# EAGLE design Arduino_sensors (EAGLE 7.6.0)
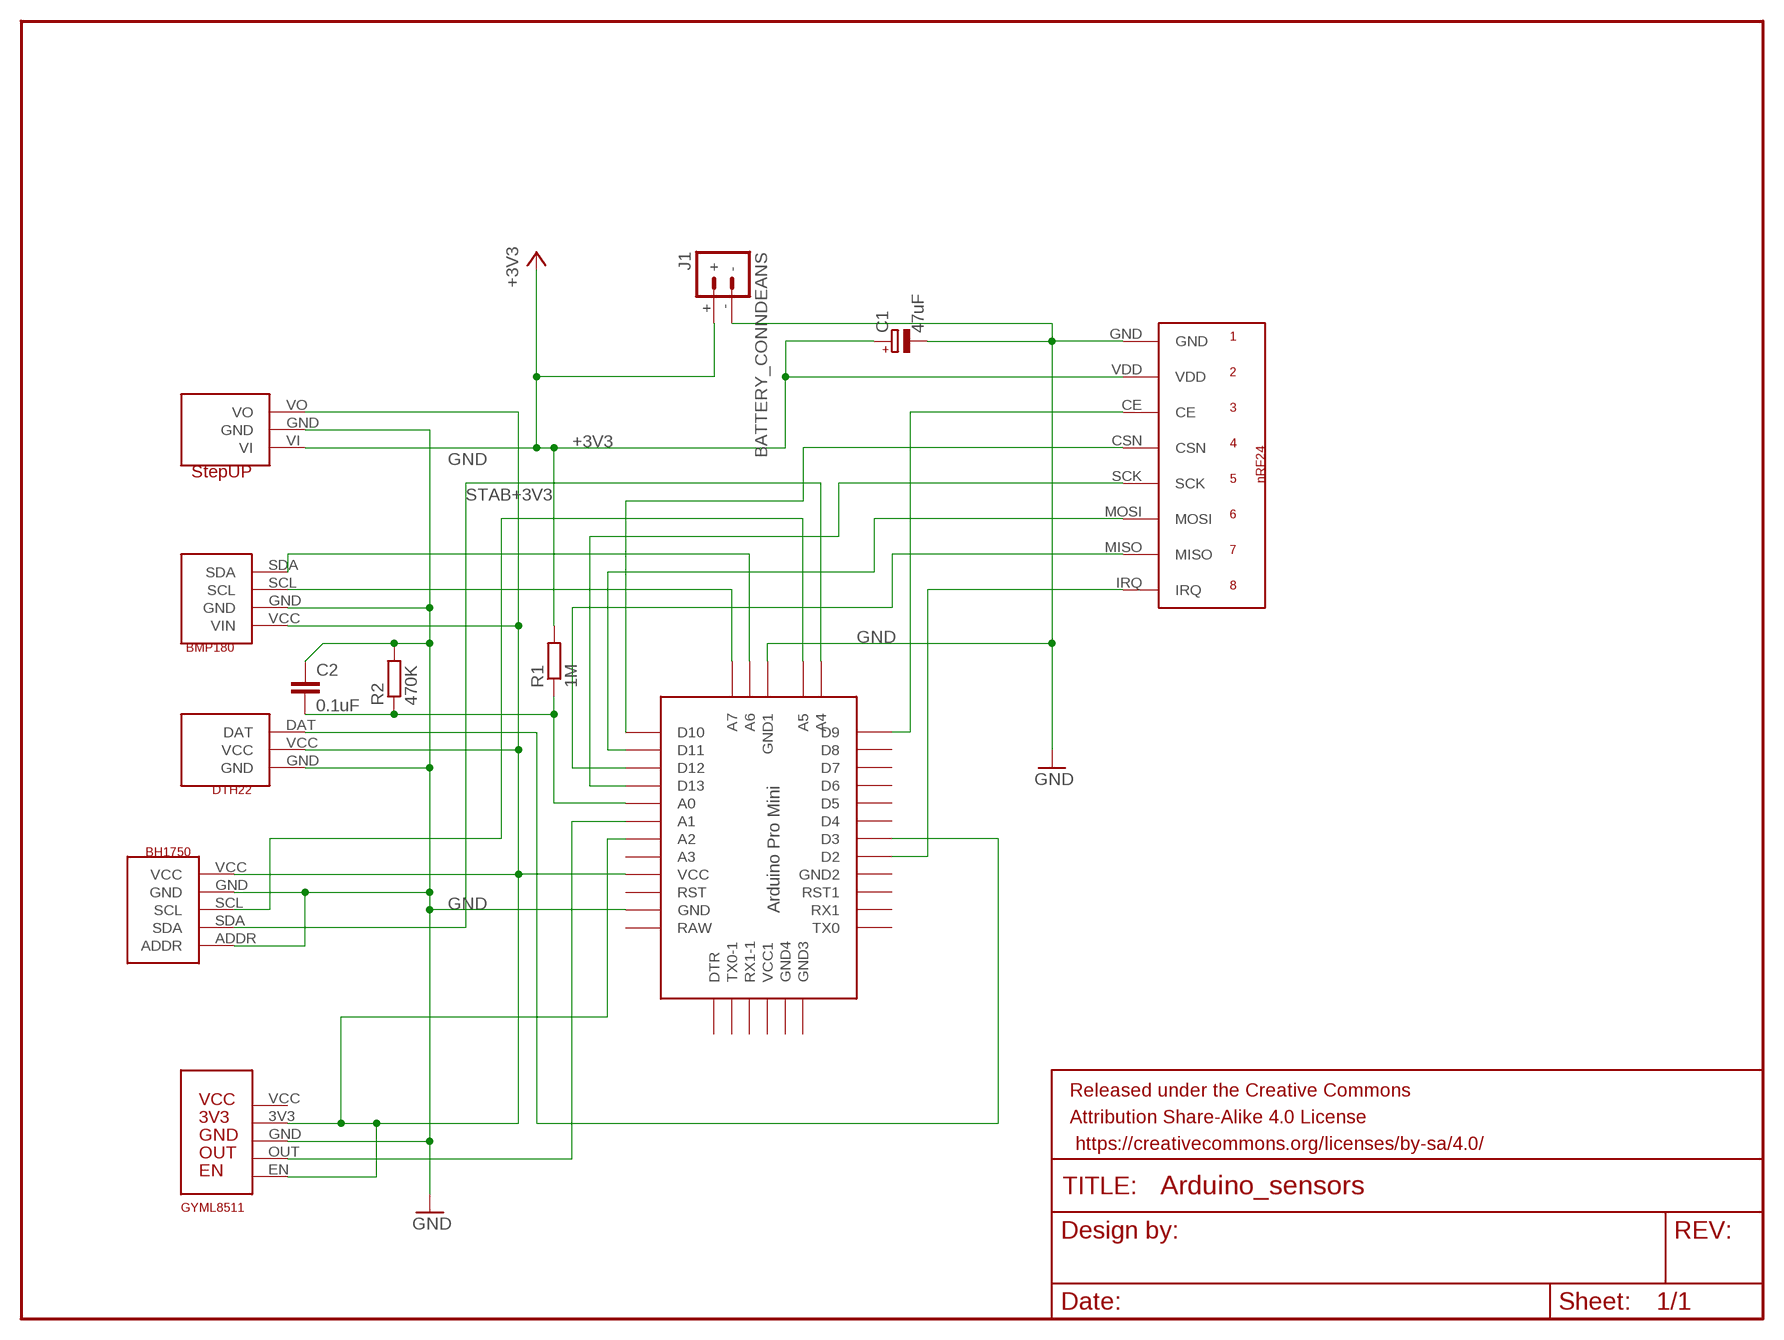
[diagram p0: schematic, sheet 1]

## Parts
ARDUINO_MINI  ABK-PRO-MINI  [ABK-PRO-MINI]
BH1  BH1750  [BH1750]
BMP1  BMP180  [BMP180]
C1  47uF  CPOL-EUE2.5-6  [E2,5-6]
C2  0.1uF  C-EU025-025X050  [C025-025X050]
DTH1  DTH22  [DHT22]
FRAME1  FRAME-LETTER  [CREATIVE_COMMONS]
J1  BATTERY_CONNDEANS  [DEANS]
R1  1M  R-EU_0207/7  [0207/7]
R2  470K  R-EU_0207/7  [0207/7]
STEPUP1  STEPUP  [STEPUP]
U$1  GY8511UV_SNR  [GYML8511]
U$2  NRF24  [NRF24]

## Nets
+3V3: C1.+ J1.+ R1.2 STEPUP1.VI U$2.VDD
GND: ARDUINO_MINI.GND ARDUINO_MINI.GND4(GND1) BH1.ADDR BH1.GND BMP1.GND C1.- C2.1 DTH1.GND J1.- R2.2 STEPUP1.GND U$1.GND U$2.GND
N$1: ARDUINO_MINI.D3 DTH1.DAT
N$2: ARDUINO_MINI.A1 U$1.OUT
N$3: ARDUINO_MINI.D9 U$2.CE
N$4: ARDUINO_MINI.D10 U$2.CSN
N$5: ARDUINO_MINI.D13 U$2.SCK
N$6: ARDUINO_MINI.D11 U$2.MOSI
N$7: ARDUINO_MINI.D2 U$2.IRQ
N$8: ARDUINO_MINI.D12 U$2.MISO
N$9: ARDUINO_MINI.A6 BMP1.SDA
N$10: ARDUINO_MINI.A7 BMP1.SCL
N$11: ARDUINO_MINI.A5 BH1.SCL
N$12: ARDUINO_MINI.A4 BH1.SDA
N$13: ARDUINO_MINI.A0 C2.2 R1.1 R2.1
STAB+3V3: ARDUINO_MINI.A2 ARDUINO_MINI.VCC BH1.VCC BMP1.VCC(VIN) DTH1.VCC STEPUP1.VO U$1.3V3 U$1.EN
Unconnected: ARDUINO_MINI.A3 ARDUINO_MINI.D4 ARDUINO_MINI.D5 ARDUINO_MINI.D6 ARDUINO_MINI.D7 ARDUINO_MINI.D8 ARDUINO_MINI.DTR ARDUINO_MINI.GND1(GND2) ARDUINO_MINI.GND2(GND3) ARDUINO_MINI.GND3(GND4) ARDUINO_MINI.RAW ARDUINO_MINI.RST ARDUINO_MINI.RST1 ARDUINO_MINI.RX1 ARDUINO_MINI.RX1-1 ARDUINO_MINI.TX0 ARDUINO_MINI.TX0-1 ARDUINO_MINI.VCC1 U$1.VCC

## Library data of the parts
ARDUINO_MINI = Arduino-clone:ABK-PRO-MINI: ABK Pro-Mini Arduino Clone
BH1 = BH1750:BH1750: Ligh intensity sensor -I2C -2.4-3.6V
BMP1 = BMP180:BMP180: Pressure sensor Supply Voltage: 3.3 V range: 300-1100 hPa 0.03hPa / 0.25m resolution -pressure sensor -19.V->3.6V -I2C
C1 = rcl:CPOL-EU: POLARIZED CAPACITOR, European symbol
C2 = rcl:C-EU: CAPACITOR, European symbol
DTH1 = DHT22:DTH22: Temp & Humid sensor 3.3 - 5V DC Hum +-2% Temp +- 0.5°C
FRAME1 = SparkFun-Aesthetics:FRAME-LETTER: Schematic Frame Standard 8.5x11 US Letter frame
J1 = SparkFun-Connectors:BATTERY_CONN: Various footprints for battery connectors
R1 R2 = resistor:R-EU_: RESISTOR, European symbol
STEPUP1 = StepUP:STEPUP: Step-up convertor from 0.8V -> 3.3V Input 3.3V
U$1 = GYML8511_SOCKET:GY8511: ultraviolet light sensor
U$2 = NRF:NRF24: nRF24 2.4ghz

## Board
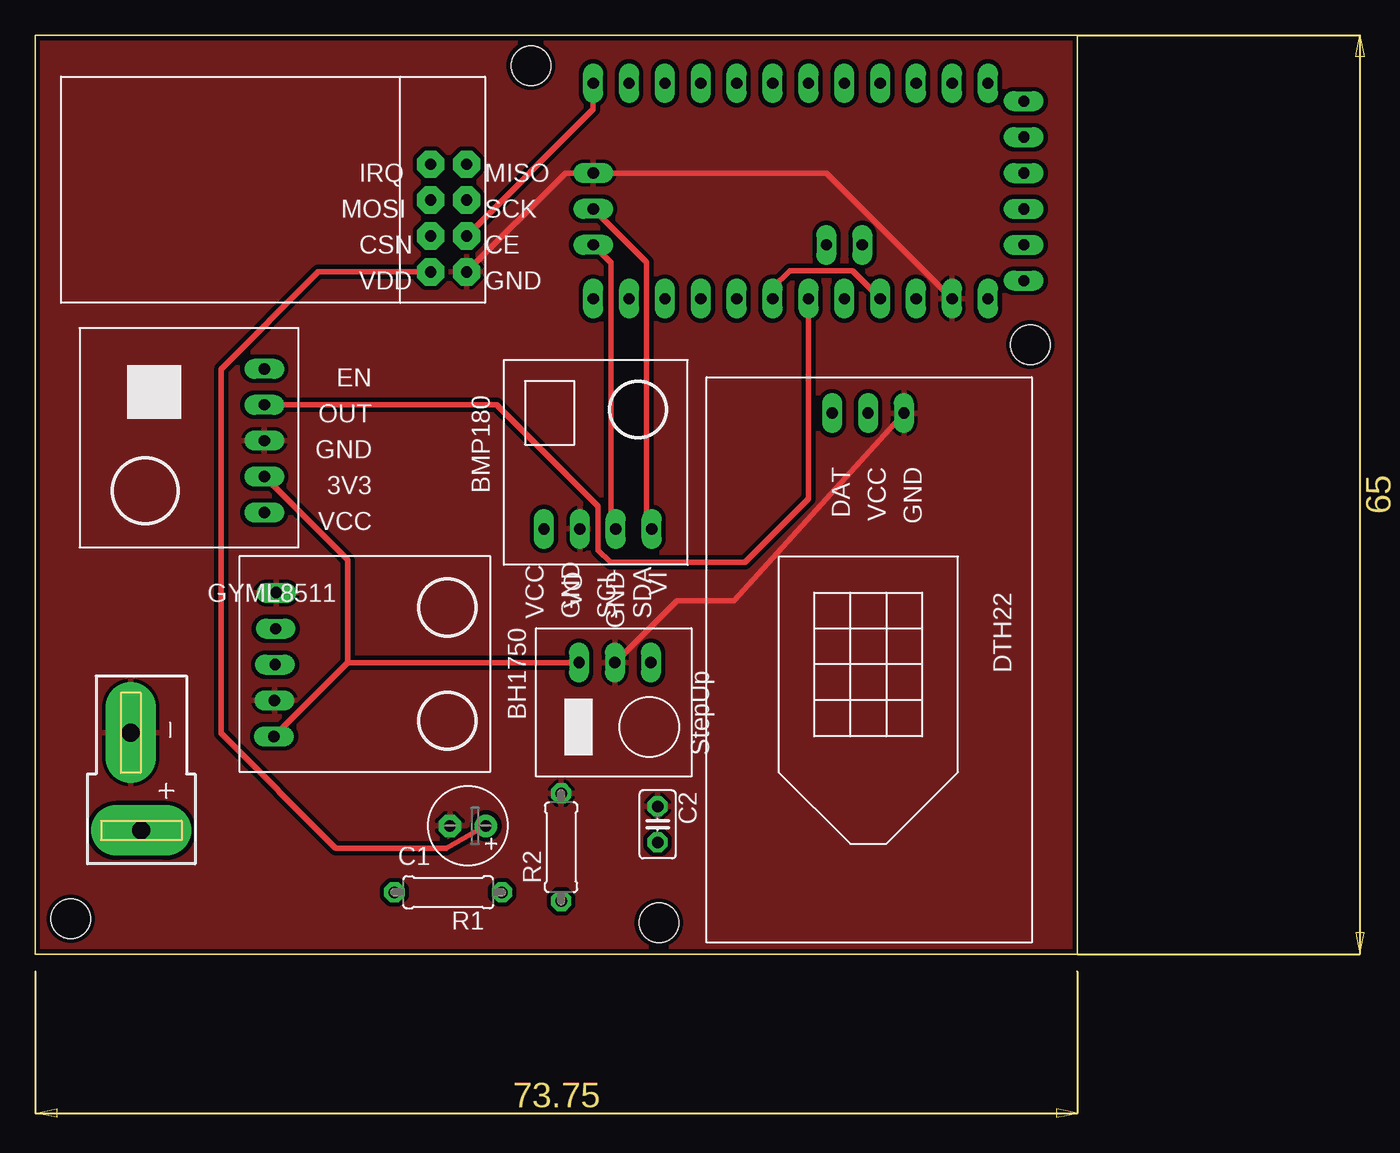
[diagram p1: board, top side]
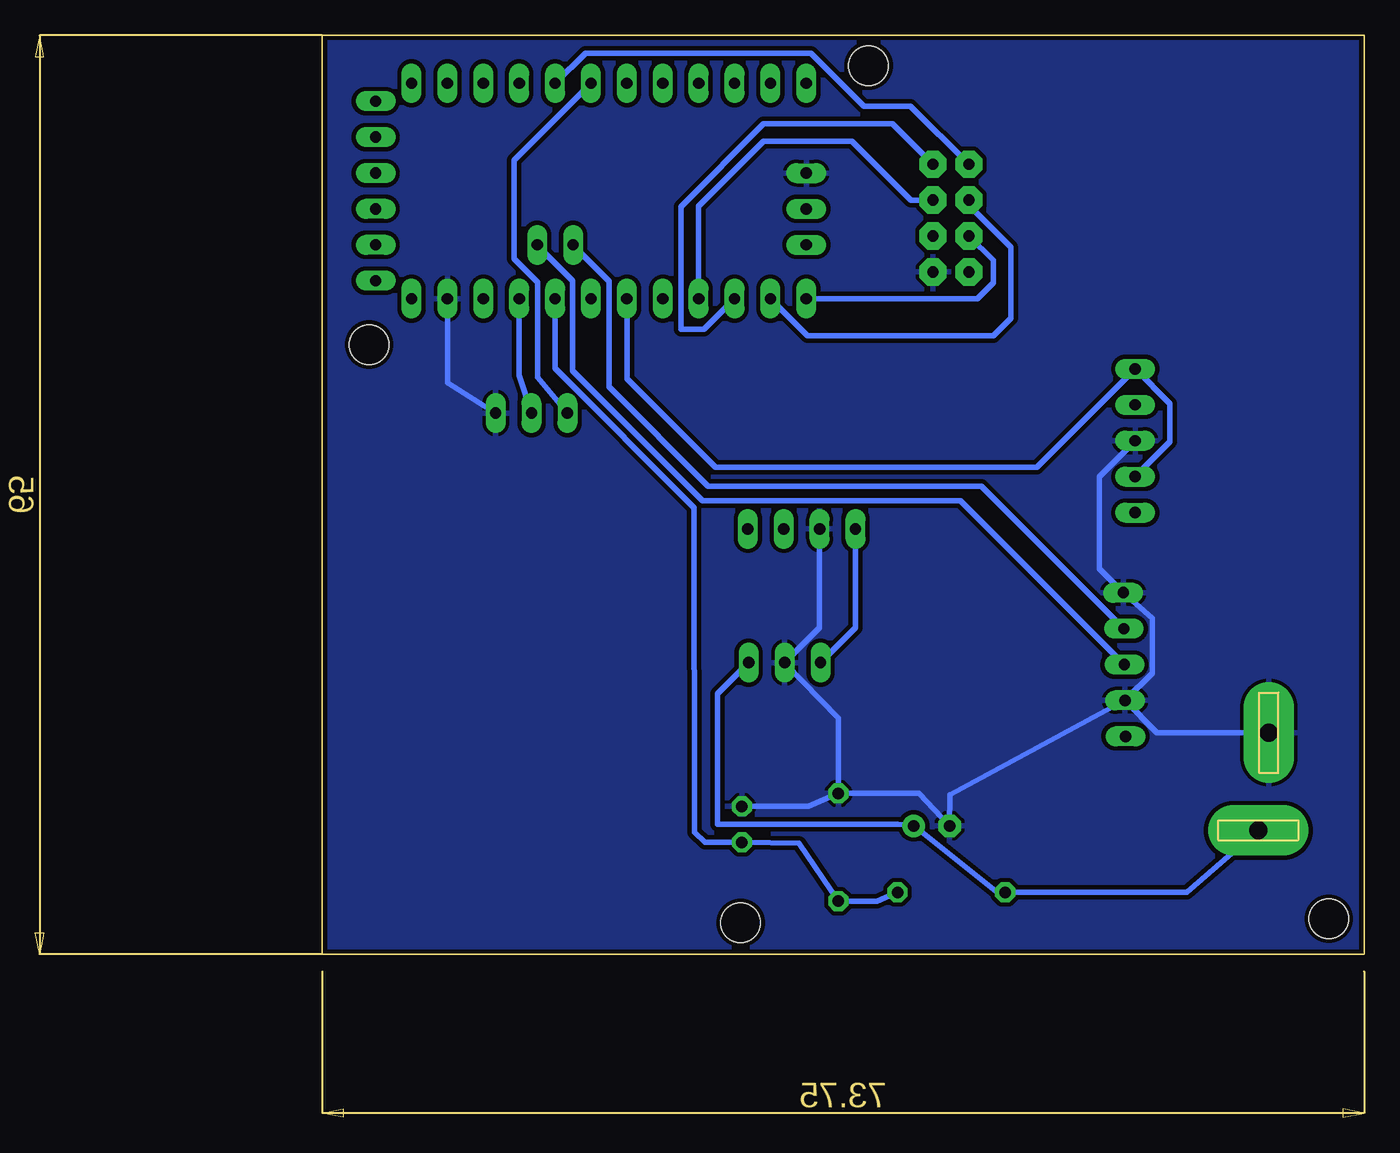
[diagram p2: board, bottom side, seen from below]

Size 73.75 x 65 mm. Coordinates in mm from the lower left corner, seen from the top.
Outline: 0,0 0,65 73.75,65 73.75,0 0,0
Copper layers (1*16): Top 0.035mm / dielectric 1.5mm / Bottom 0.035mm
Design rules "SparkFun": minimum track width 8mil, minimum drill 20mil, track to track 8mil, track to pad 8mil, pad to pad 8mil, via to via 8mil, smd to smd 8mil, copper to edge 8mil, drill to drill 8mil, minimum pad ring 12mil, minimum via ring 10mil, stop-mask expansion 4mil, vias tented up to drill 20mil, thermal gap 10mil
Holes 2.8 mm at 35.08,62.86 2.5,2.5 44.13,2.23 70.42,43.12

### Footprints (pad centres in the part's own frame; a part is rotated, then mirrored left to right if it is on the bottom)
ABK-PRO-MINI = drill 0.8 long: A0 10.16,-3.81; A1 10.16,-6.35; A2 10.16,-8.89; A3 10.16,-11.43; A4 6.35,-5.08; A5 6.35,-2.54; A6 3.81,-21.59; A7 6.35,-21.59; D2 -5.08,-3.81; D3 -5.08,-6.35; D4 -5.08,-8.89; D5 -5.08,-11.43; D6 -5.08,-13.97; D7 -5.08,-16.51; D8 -5.08,-19.05; D9 -5.08,-21.59; D10 10.16,-21.59; D11 10.16,-19.05; D12 10.16,-16.51; D13 10.16,-13.97; DTR 8.89,8.89; GND 10.16,3.81; GND1 -5.08,-1.27; GND2 -3.81,8.89; GND3 -1.27,8.89; GND4 1.27,-21.59; RAW 10.16,6.35; RST 10.16,1.27; RST1 -5.08,1.27; RX1 -5.08,3.81; RX1-1 3.81,8.89; TX0 -5.08,6.35; TX0-1 6.35,8.89; VCC 10.16,-1.27; VCC1 1.27,8.89
BH1750 = drill 0.8 long: ADDR -5.04,3.89; GND 2.58,3.77; SCL 0.04,3.81; SDA -2.5,3.85; VCC 5.12,3.73
BMP180 = drill 0.8 long: GND 2.54,7.62; SCL 2.54,5.08; SDA 2.54,2.54; VCC 2.54,10.16
E2,5-6 = drill 0.813 pad 1.6: + -1.27,0 | drill 0.813 pad 1.6 octagon: - 1.27,0
C025-025X050 = drill 0.813 octagon: 1 -1.27,0; 2 1.27,0
DHT22 = drill 0.8 long: DAT 2.54,8.87; GND 2.54,13.95; VCC 2.54,11.41
DEANS = drill 1.27 pad 3.556 long: + 0,0; - 0.737,-6.921
0207/7 = drill 0.813 octagon: 1 -3.81,0; 2 3.81,0
STEPUP = drill 0.8 long: GND -1.37,0.5; VI -1.37,3.04; VO -1.37,-2.04
GYML8511 = drill 0.8 long: 3V3 2.42,10.5; EN 2.42,2.88; GND 2.42,7.96; OUT 2.42,5.42; VCC 2.42,13.04
NRF24 = drill 0.8 pad 1.93 octagon: CE 12.7,-1.27; CSN 10.16,-1.27; GND 12.7,-3.81; IRQ 10.16,3.81; MISO 12.7,3.81; MOSI 10.16,1.27; SCK 12.7,1.27; VDD 10.16,-3.81

### Placement (x,y rotation side)
ARDUINO_MINI  61.07,56.53 270 top
BH1  13.16,20.52 270 top
BMP1  46.16,27.54 90 top
C1  30.61,9.07 180 top
C2  44.04,9.18 270 top
DRILEGEND  [DRILEGEND]  -131.4,-5.06 0 top  (outside the outline)
DTH1  47.52,40.81 270 top
FRAME1  -110.49,41.93 0 top  (outside the outline)
J1  7.5,8.75 180 top
R1  29.22,4.37 180 top
R2  37.22,7.55 90 top
STEPUP1  40.52,19.25 270 top
U$1  18.62,44.28 180 top
U$2  17.82,52.07 0 top

### Tracks (layer width: path | path; a pad name or v marks a point on that pad's centre or on a via)
+3V3
  Top 0.406: U$2.VDD 20.02,48.26 13.14,41.38 13.14,15.61 21.25,7.5 29.06,7.5 C1.+
  Bottom 0.406: J1.+ 12.54,4.37 R1.2 25.73,4.17 C1.+ 33.02,9.18 45.77,9.18 45.77,18.41 STEPUP1.VI
GND  (via drill 0.8)
  Top 0.406: 38.66,30.08 BMP1.GND | ARDUINO_MINI.GND 55.99,55.26 ARDUINO_MINI.GND4 37.52,55.26 U$2.GND | DTH1.GND 49.45,25 45.4,25 STEPUP1.GND
  Bottom 0.406: U$1.GND 18.75,33.77 18.75,27.26 BH1.ADDR | J1.- 14.66,15.67 BH1.GND | v17.05,25.57 15,23.75 15,19.87 BH1.GND | DTH1.GND 64.88,40.43 ARDUINO_MINI.GND | R2.2 37.22,16.68 STEPUP1.GND 38.54,23.1 BMP1.GND | C2.1 39.33,10.45 R2.2 | R2.2 34.64,11.37 32.5,11.36 31.52,11.36 C1.- 29.34,11.28 BH1.GND
  pour Top (isolate 0.305): 73.75,65 73.75,-1.25 0,-1.25 0,65
  pour Bottom (isolate 0.305): 73.75,65 73.75,0 0,0 0,65
N$1
  Bottom 0.406: DTH1.DAT 58.5,40.83 58.5,47.55 60.16,49.21 60.16,56.16 ARDUINO_MINI.D3
N$2
  Top 0.406: U$1.OUT 32.66,38.86 39.83,31.69 39.83,28.59 40.7,27.71 50.22,27.71 54.72,32.22 ARDUINO_MINI.A1
N$3
  Top 0.406: U$2.CE 39.48,59.76 ARDUINO_MINI.D9
N$4
  Bottom 0.406: U$2.CSN 26.25,49.07 26.25,47.5 27.38,46.37 ARDUINO_MINI.D10
N$5
  Bottom 0.406: U$2.SCK 32.09,53.34 36.25,57.5 42.5,57.5 47.1,52.9 ARDUINO_MINI.D13
N$6
  Bottom 0.406: U$2.MOSI 27.98,52.98 25,50 25,45 26.25,43.75 39.4,43.75 ARDUINO_MINI.D11
N$7
  Bottom 0.406: ARDUINO_MINI.D2 55.12,63.75 39.17,63.75 35.42,60 32.1,60 U$2.IRQ
N$8
  Bottom 0.406: U$2.MISO 33.39,58.75 42.5,58.75 48.36,52.89 48.36,44.22 46.72,44.22 ARDUINO_MINI.D12
N$9
  Top 0.406: BMP1.SDA 43.24,30.45 43.24,48.95 ARDUINO_MINI.A6
N$10
  Top 0.406: BMP1.SCL 40.76,30.41 40.76,48.91 ARDUINO_MINI.A7
N$11
  Bottom 0.406: ARDUINO_MINI.A5 58.53,50.14 56.02,47.63 56.02,41.26 46.84,32.08 28.57,32.08 BH1.SCL
N$12
  Bottom 0.406: ARDUINO_MINI.A4 55.99,50.16 53.43,47.6 53.43,40.12 46.42,33.12 27.11,33.12 BH1.SDA
N$13
  Bottom 0.406: R1.1 34.49,3.75 R2.1 40.01,7.83 C2.2 46.66,7.9 47.41,8.63 47.42,31.56 57.26,41.44 57.26,43.65 ARDUINO_MINI.A0
STAB+3V3  (via drill 0.8)
  Top 0.406: BH1.VCC 22.11,20.62 | 22.11,20.62 STEPUP1.VO | v16.2,33.8 22.11,27.89 22.11,20.62 | ARDUINO_MINI.A2 52.18,47.13 53.4,48.35 57.81,48.35 ARDUINO_MINI.VCC
  Bottom 0.406: U$1.3V3 v16.2,33.8 13.75,36.25 13.75,38.95 U$1.EN 23.17,34.44 45.91,34.44 52.18,40.7 ARDUINO_MINI.A2 | STEPUP1.VO 36,23.1 BMP1.VCC | DTH1.VCC 59.8,40.94 ARDUINO_MINI.VCC

### Text on the board
DrillLegend: LAYER-STACK
DrillLegend_01-16: 01-16